# Altium schematic sheet FoxSense_Schematic.SchDoc
size A4; SheetNumber: 1; SheetTotal: 3
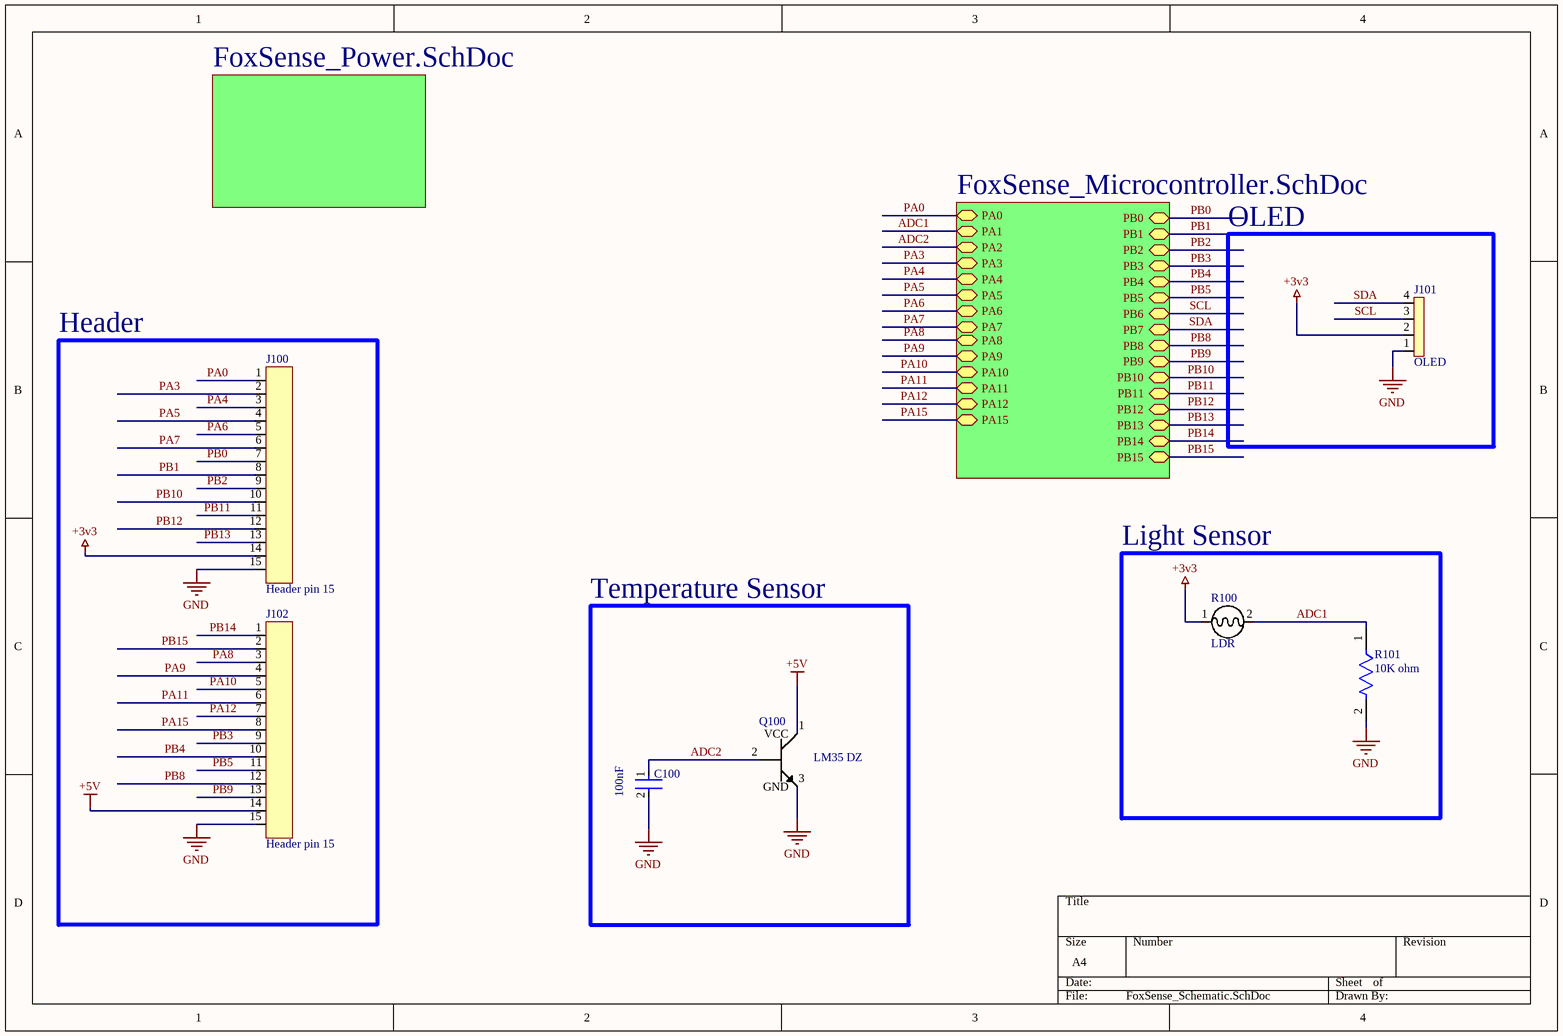
[diagram p0: FoxSense_Schematic.SchDoc]

## Parts
C100  100nF  [Capacitor_SMD_0805]
J100  Header pin 15  [Header15]
J101  OLED  [Header4]
J102  Header pin 15  [Header15]
Q100  LM35 DZ  [LM35]
R100  LDR  [LDR]
R101  10K ohm  [Resistor_SMD_0805]

## Blocks framed on the sheet
OLED: J101
Header: J100 J102
Light Sensor: R100 R101
Temperature Sensor: C100 Q100

## Sub-sheets
U_FoxSense_Microcontroller = FoxSense_Microcontroller.SchDoc: PA0 (bidir), PA1 (bidir), PA2 (bidir), PA3 (bidir), PA4 (bidir), PA5 (bidir), PA6 (bidir), PA7 (bidir), PB0 (bidir), PB1 (bidir), PB2 (bidir), PB10 (bidir), PB11 (bidir), PB12 (bidir), PB13 (bidir), PB14 (bidir), PB15 (bidir), PA8 (bidir), PA9 (bidir), PA10 (bidir), PA11 (bidir), PA12 (bidir), PA15 (bidir), PB3 (bidir), PB4 (bidir), PB5 (bidir), PB6 (bidir), PB7 (bidir), PB8 (bidir), PB9 (bidir)
U_FoxSense_Power = FoxSense_Power.SchDoc: no entries

## Nets
+3v3: J100.14 J101.2 R100.1
+5V: J102.14 Q100.1(VCC)
GND: C100.2 J100.15 J101.1 J102.15 Q100.3(GND) R101.2
ADC1: R100.2 R101.1 ; sheet U_FoxSense_Microcontroller/PA1
ADC2: C100.1 Q100.2 ; sheet U_FoxSense_Microcontroller/PA2
PA0: J100.1 ; sheet U_FoxSense_Microcontroller/PA0
PA3: J100.2 ; sheet U_FoxSense_Microcontroller/PA3
PA4: J100.3 ; sheet U_FoxSense_Microcontroller/PA4
PA5: J100.4 ; sheet U_FoxSense_Microcontroller/PA5
PA6: J100.5 ; sheet U_FoxSense_Microcontroller/PA6
PA7: J100.6 ; sheet U_FoxSense_Microcontroller/PA7
PA8: J102.3 ; sheet U_FoxSense_Microcontroller/PA8
PA9: J102.4 ; sheet U_FoxSense_Microcontroller/PA9
PA10: J102.5 ; sheet U_FoxSense_Microcontroller/PA10
PA11: J102.6 ; sheet U_FoxSense_Microcontroller/PA11
PA12: J102.7 ; sheet U_FoxSense_Microcontroller/PA12
PA15: J102.8 ; sheet U_FoxSense_Microcontroller/PA15
PB0: J100.7 ; sheet U_FoxSense_Microcontroller/PB0
PB1: J100.8 ; sheet U_FoxSense_Microcontroller/PB1
PB2: J100.9 ; sheet U_FoxSense_Microcontroller/PB2
PB3: J102.9 ; sheet U_FoxSense_Microcontroller/PB3
PB4: J102.10 ; sheet U_FoxSense_Microcontroller/PB4
PB5: J102.11 ; sheet U_FoxSense_Microcontroller/PB5
PB8: J102.12 ; sheet U_FoxSense_Microcontroller/PB8
PB9: J102.13 ; sheet U_FoxSense_Microcontroller/PB9
PB10: J100.10 ; sheet U_FoxSense_Microcontroller/PB10
PB11: J100.11 ; sheet U_FoxSense_Microcontroller/PB11
PB12: J100.12 ; sheet U_FoxSense_Microcontroller/PB12
PB13: J100.13 ; sheet U_FoxSense_Microcontroller/PB13
PB14: J102.1 ; sheet U_FoxSense_Microcontroller/PB14
PB15: J102.2 ; sheet U_FoxSense_Microcontroller/PB15
SCL: J101.3 ; sheet U_FoxSense_Microcontroller/PB6
SDA: J101.4 ; sheet U_FoxSense_Microcontroller/PB7

## Library data of the parts
C100 = Capacitor_SMD_0805: capacitor smd 0805 100nF
J100 J102 = Header15
J101 = Header4: OLED 0..96 inch
Q100 = LM35
R100 = LDR: LDR DIP
R101 = Resistor_SMD_0805: Resistor SMD 0805 10 k ohm